# Altium schematic sheet MAIN.SchDoc
size A3; SheetNumber: 1; SheetTotal: 12
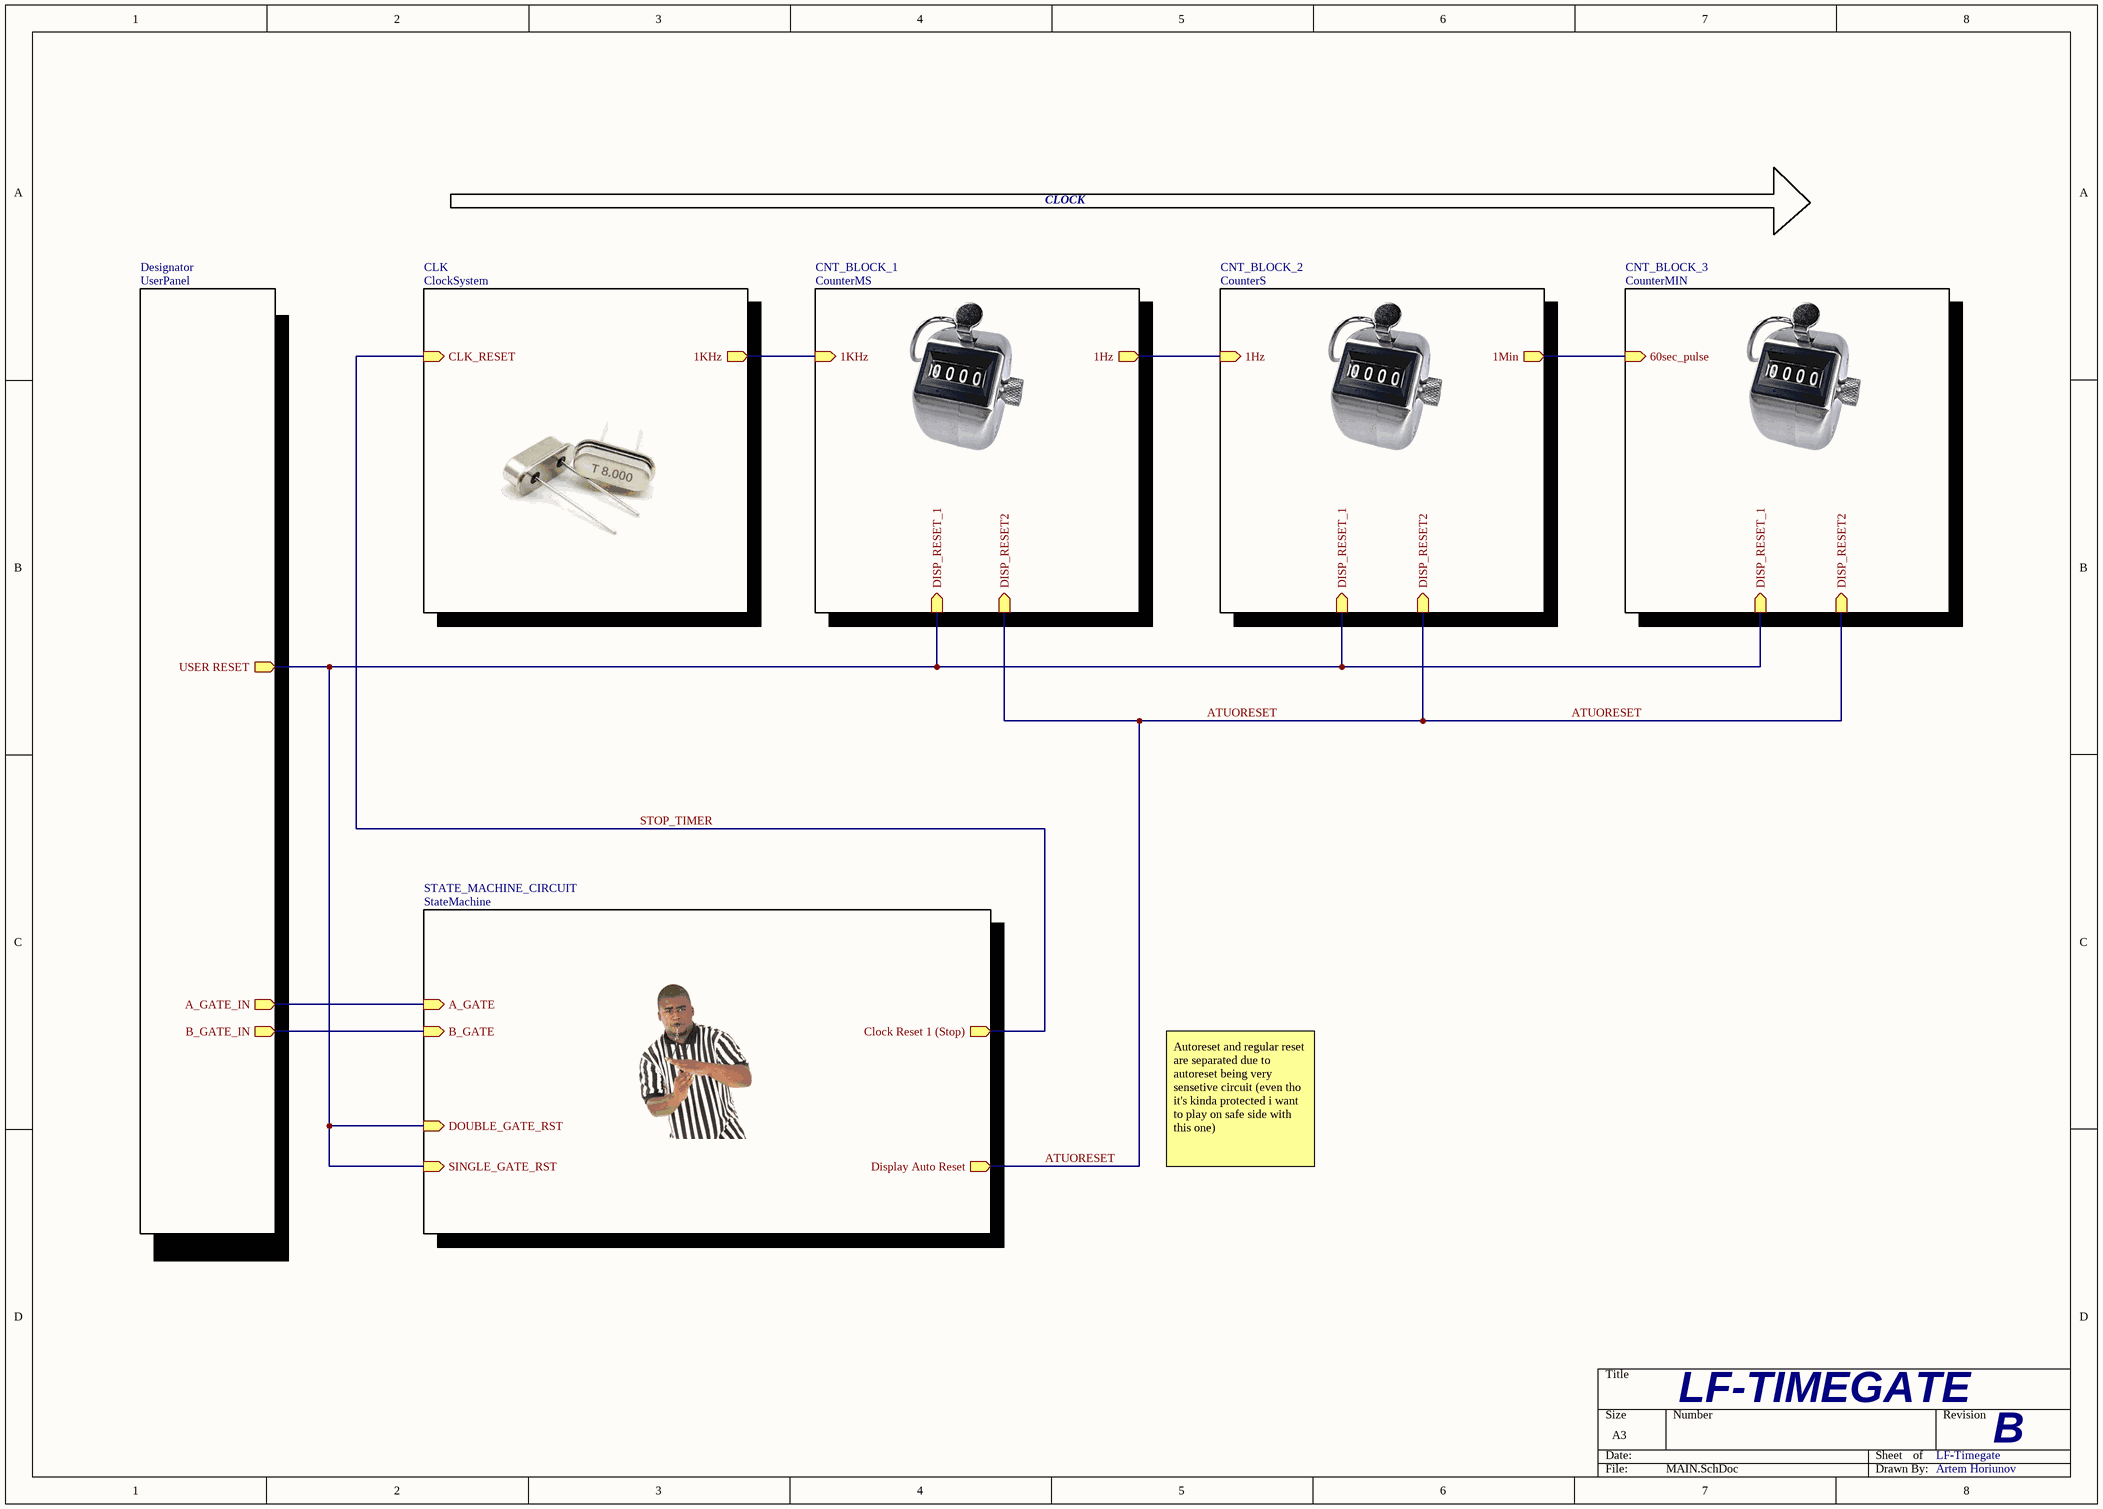
[diagram p0: MAIN.SchDoc]

## Sub-sheets
CLK = ClockSystem: CLK_RESET (in), 1KHz (out)
CNT_BLOCK_1 = CounterMS: DISP_RESET2 (in), DISP_RESET_1 (in), 1Hz (out), 1KHz (in)
CNT_BLOCK_2 = CounterS: DISP_RESET2 (in), DISP_RESET_1 (in), 1Hz (in), 1Min (out)
CNT_BLOCK_3 = CounterMIN: DISP_RESET2 (in), DISP_RESET_1 (in), 60sec_pulse (in)
Designator = UserPanel: A_GATE_IN (out), B_GATE_IN (out), USER RESET (out)
STATE_MACHINE_CIRCUIT = StateMachine: B_GATE (in), DOUBLE_GATE_RST (in), A_GATE (in), SINGLE_GATE_RST (in), Clock Reset 1 (Stop) (out), Display Auto Reset (out)

## Nets
ATUORESET: sheet CNT_BLOCK_1/DISP_RESET2, sheet CNT_BLOCK_2/DISP_RESET2, sheet CNT_BLOCK_3/DISP_RESET2, sheet STATE_MACHINE_CIRCUIT/Display Auto Reset
STOP_TIMER: sheet CLK/CLK_RESET, sheet STATE_MACHINE_CIRCUIT/Clock Reset 1 (Stop)
(unnamed): sheet CLK/1KHz, sheet CNT_BLOCK_1/1KHz
(unnamed): sheet CNT_BLOCK_1/DISP_RESET_1, sheet CNT_BLOCK_2/DISP_RESET_1, sheet CNT_BLOCK_3/DISP_RESET_1, sheet STATE_MACHINE_CIRCUIT/DOUBLE_GATE_RST, sheet STATE_MACHINE_CIRCUIT/SINGLE_GATE_RST, sheet Designator/USER RESET
(unnamed): sheet CNT_BLOCK_1/1Hz, sheet CNT_BLOCK_2/1Hz
(unnamed): sheet CNT_BLOCK_2/1Min, sheet CNT_BLOCK_3/60sec_pulse
(unnamed): sheet STATE_MACHINE_CIRCUIT/B_GATE, sheet Designator/B_GATE_IN
(unnamed): sheet STATE_MACHINE_CIRCUIT/A_GATE, sheet Designator/A_GATE_IN

## Notes on the sheet
- CLOCK
- Autoreset and regular reset are separated due to autoreset being very sensetive circuit (even tho it's kinda protected i want to play on safe side with this one)
- LF-TIMEGATE
- LF-Timegate
- B
- Artem Horiunov